# Altium schematic sheet MCU_SWD_Program.SchDoc
size A
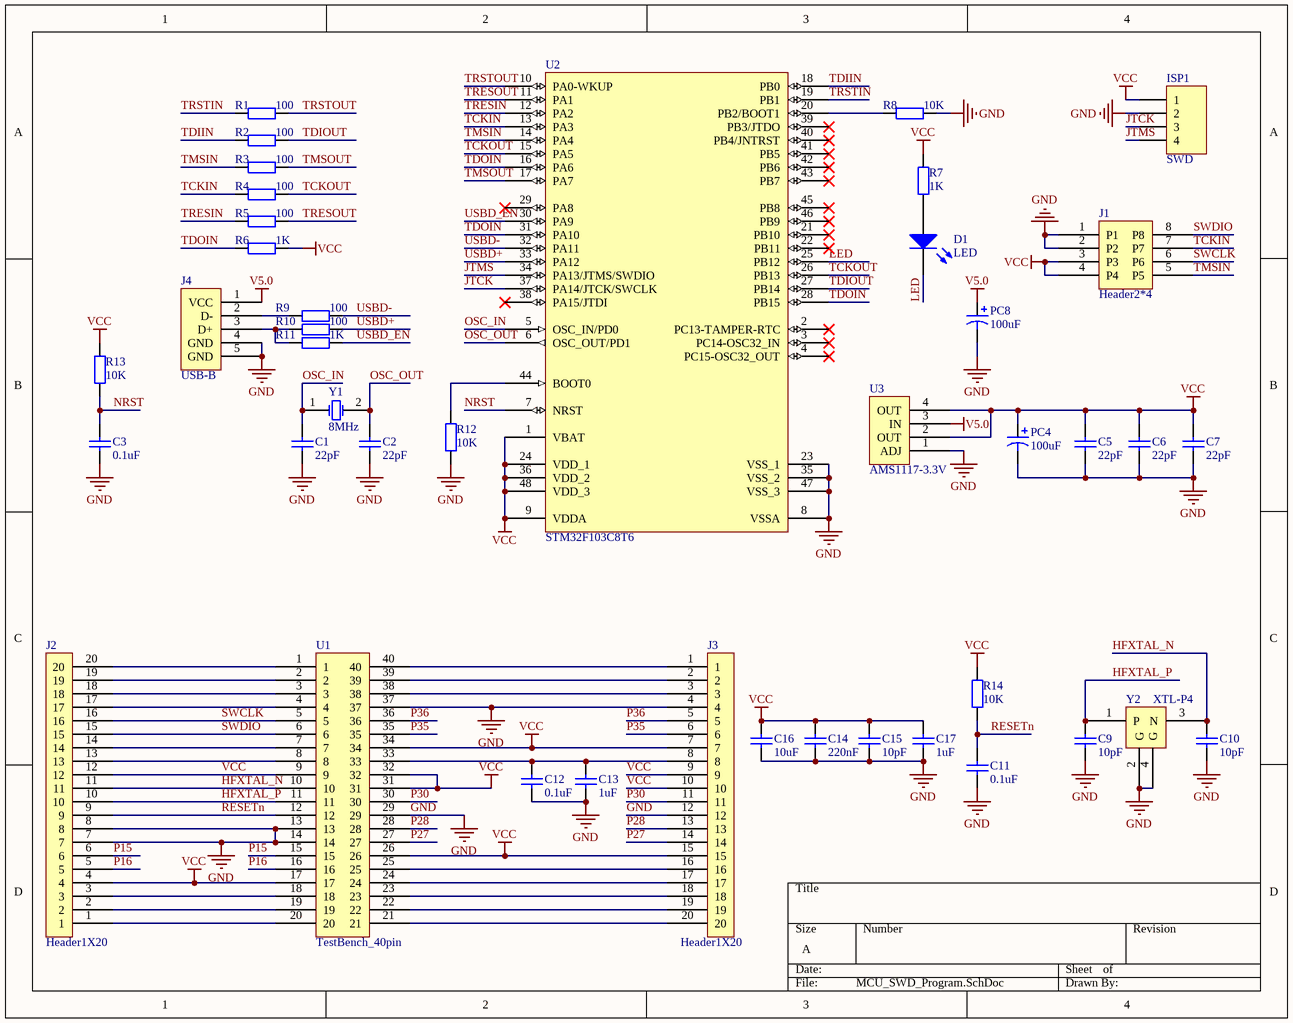
[diagram p0: MCU_SWD_Program.SchDoc]

## Parts
C1  value 22pF  [C0603]
C2  value 22pF  [C0603]
C3  value 0.1uF  [C0603]
C5  value 22pF  [C0603]
C6  value 22pF  [C0603]
C7  value 22pF  [C0603]
C9  value 10pF  [C0603]
C10  value 10pF  [C0603]
C11  value 0.1uF  [C0603]
C12  value 0.1uF  [C0603]
C13  value 1uF  [C0603]
C14  value 220nF  [C0603]
C15  value 10pF  [C0603]
C16  value 10uF  [C0603]
C17  value 1uF  [C0603]
D1  LED  [D-0805]
ISP1  SWD  [HDR1X4]
J1  Header2*4  [HDR2X4]
J2  Header1X20  [HDR2.54-1X20]
J3  Header1X20  [HDR2.54-1X20]
J4  USB-B  [USB-B]
PC4  value 100uF  [C1206]
PC8  value 100uF  [C1206]
R1  value 100  [R0603]
R2  value 100  [R0603]
R3  value 100  [R0603]
R4  value 100  [R0603]
R5  value 100  [R0603]
R6  value 1K  [r0603]
R7  value 1K  [R0603]
R8  value 10K  [R0603]
R9  value 100  [R0603]
R10  value 100  [R0603]
R11  value 1K  [R0603]
R12  value 10K  [R0603]
R13  value 10K  [R0603]
R14  value 10K  [R0603]
U1  TestBench_40pin  [DIP40]
U2  STM32F103C8T6  [LQFP-48]
U3  AMS1117-3.3V  [SOT-223]
Y1  8MHz  [XTAL-SMD2]
Y2  XTL-P4  [X3225]

## Nets
GND: C1.2 C2.2 C3.2 C5.2 C6.2 C7.2 C9.2 C10.2 C11.2 C12.2 C13.2 C14.2 C15.2 C16.2 C17.2 ISP1.2 J1.1(P1) J1.2(P2) J2.7 J2.8 J3.4 J3.12 J4.4(GND) J4.5(GND) PC4.2 PC8.2 R8.2 R12.2 U1.13 U1.14 U1.29 U1.37 U2.8(VSSA) U2.23(VSS_1) U2.35(VSS_2) U2.47(VSS_3) U3.1(ADJ) Y2.2(G) Y2.4(G)
V5.0: J4.1(VCC) PC8.1 U3.3(IN)
VCC: C5.1 C6.1 C7.1 C14.1 C15.1 C16.1 C17.1 ISP1.1 J1.3(P3) J1.4(P4) J2.4 J2.12 J3.7 J3.9 J3.10 J3.15 PC4.1 R6.2 R7.2 R13.2 R14.2 U1.9 U1.17 U1.26 U1.31 U1.32 U1.34 U2.1(VBAT) U2.9(VDDA) U2.24(VDD_1) U2.36(VDD_2) U2.48(VDD_3) U3.2(OUT) U3.4(OUT)
HFXTAL_N: C10.1 J2.11 U1.10 Y2.3(N)
HFXTAL_P: C9.1 J2.10 U1.11 Y2.1(P)
JTCK: ISP1.3 U2.37(PA14/JTCK/SWCLK)
JTMS: ISP1.4 U2.34(PA13/JTMS/SWDIO)
LED: D1.2(K) U2.25(PB12)
NRST: C3.1 R13.1 U2.7(NRST)
OSC_IN: C1.1 U2.5(OSC_IN/PD0) Y1.1(OSC1)
OSC_OUT: C2.1 U2.6(OSC_OUT/PD1) Y1.2(OSC2)
P15: J2.6 U1.15
P16: J2.5 U1.16
P27: J3.14 U1.27
P28: J3.13 U1.28
P30: J3.11 U1.30
P35: J3.6 U1.35
P36: J3.5 U1.36
RESETn: C11.1 J2.9 R14.1 U1.12
SWCLK: J1.6(P6) J2.16 U1.5
SWDIO: J1.8(P8) J2.15 U1.6
TCKIN: J1.7(P7) R4.1 U2.13(PA3)
TCKOUT: R4.2 U2.15(PA5) U2.26(PB13)
TDIIN: R2.1 U2.18(PB0)
TDIOUT: R2.2 U2.27(PB14)
TDOIN: R6.1 U2.16(PA6) U2.28(PB15) U2.31(PA10)
TMSIN: J1.5(P5) R3.1 U2.14(PA4)
TMSOUT: R3.2 U2.17(PA7)
TRESIN: R5.1 U2.12(PA2)
TRESOUT: R5.2 U2.11(PA1)
TRSTIN: R1.1 U2.19(PB1)
TRSTOUT: R1.2 U2.10(PA0-WKUP)
USBD+: R10.2 U2.33(PA12)
USBD-: R9.2 U2.32(PA11)
USBD_EN: R11.2 U2.30(PA9)
NetC12_1: C12.1 C13.1 J3.8 U1.33
NetD1_1: D1.1(A) R7.1
NetJ2_1: J2.1 U1.20
NetJ2_2: J2.2 U1.19
NetJ2_3: J2.3 U1.18
NetJ2_13: J2.13 U1.8
NetJ2_14: J2.14 U1.7
NetJ2_17: J2.17 U1.4
NetJ2_18: J2.18 U1.3
NetJ2_19: J2.19 U1.2
NetJ2_20: J2.20 U1.1
NetJ3_1: J3.1 U1.40
NetJ3_2: J3.2 U1.39
NetJ3_3: J3.3 U1.38
NetJ3_16: J3.16 U1.25
NetJ3_17: J3.17 U1.24
NetJ3_18: J3.18 U1.23
NetJ3_19: J3.19 U1.22
NetJ3_20: J3.20 U1.21
NetJ4_2: J4.2(D-) R9.1
NetJ4_3: J4.3(D+) R10.1 R11.1
NetR8_1: R8.1 U2.20(PB2/BOOT1)
NetR12_1: R12.1 U2.44(BOOT0)

Not connected (* = marked no-connect by the designer): U2 2(PC13-TAMPER-RTC)* 3(PC14-OSC32_IN)* 4(PC15-OSC32_OUT)* 21(PB10)* 22(PB11)* 29(PA8)* 38(PA15/JTDI)* 39(PB3/JTDO)* 40(PB4/JNTRST)* 41(PB5)* 42(PB6)* 43(PB7)* 45(PB8)* 46(PB9)*

## Library data of the parts
C1-C3 C5-C7 C9-C17 = Cap: Capacitor; Published: 8-Jun-2000; LatestRevisionDate: 17-Jul-2002; LatestRevisionNote: Re-released for DXP Platform.; PackageReference: RAD-0.3; Publisher: Altium Limited
D1 = LED2: Typical RED, GREEN, YELLOW, AMBER GaAs LED; Published: 8-Jun-2000; LatestRevisionDate: 17-Jul-2002; LatestRevisionNote: Re-released for DXP Platform.; PackageVersion: Feb-2002; PackageReference: 3.2X1.6X1.1; Publisher: Altium Limited
ISP1 = Header 4: Header, 4-Pin; LatestRevisionDate: 17-Jul-2002; LatestRevisionNote: Re-released for DXP Platform.; Publisher: Altium Limited
J1 = Header2X4
PC4 PC8 = Cap Pol3: Polarized Capacitor (Surface Mount); Published: 8-Jun-2000; LatestRevisionDate: 29-May-2009; LatestRevisionNote: IPC-7351 Footprint Added.; PackageReference: C0805; Publisher: Altium Limited; PackageDescription: Chip Capacitor
R1-R14 = Res2: Resistor; Published: 8-Jun-2000; LatestRevisionDate: 17-Jul-2002; LatestRevisionNote: Re-released for DXP Platform.; PackageReference: AXIAL-0.4; Publisher: Altium Limited
Y1 = XTAL: Crystal Oscillator; Published: 8-Jun-2000; LatestRevisionDate: 17-Jul-2002; LatestRevisionNote: Re-released for DXP Platform.; PackageReference: R38; Publisher: Altium Limited